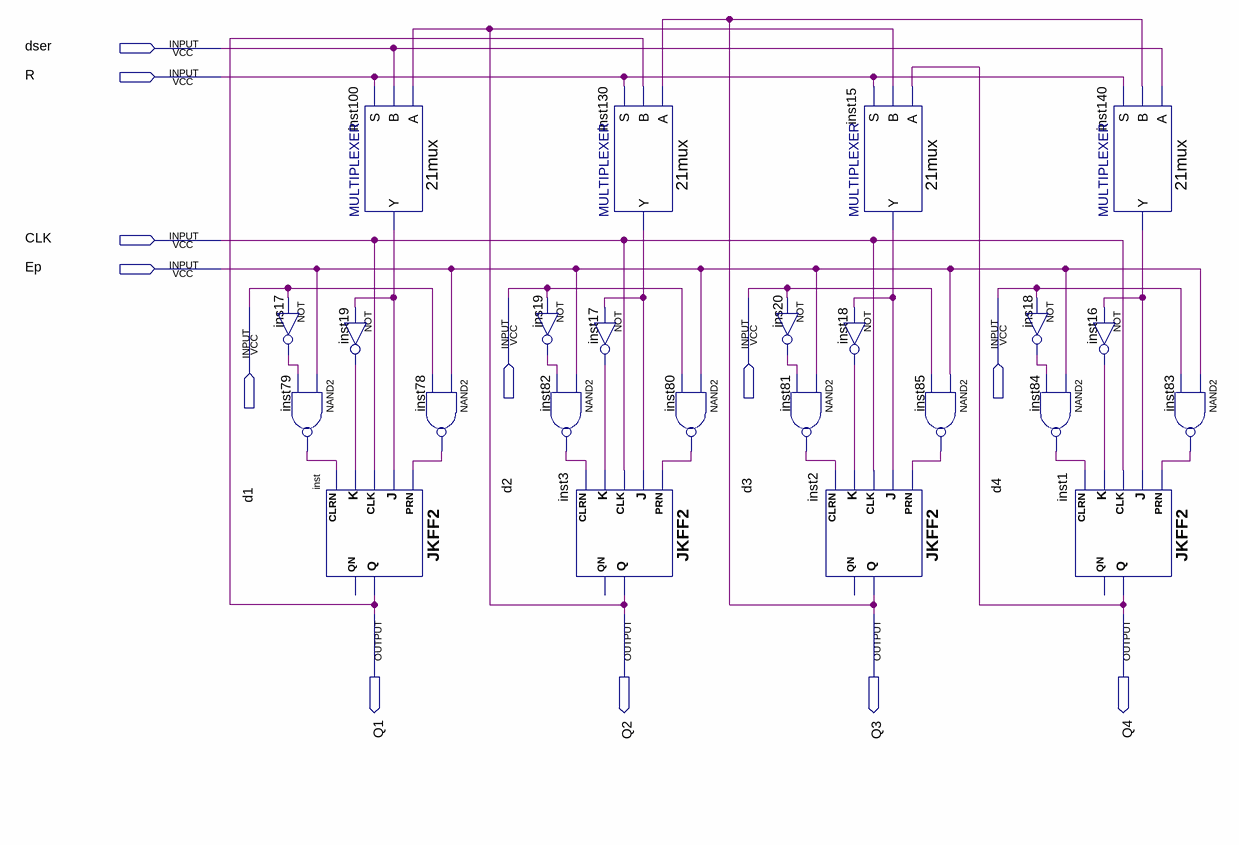
[diagram p0: schematic sheet]
// Quartus schematic q52.bdf as structural Verilog: 24 symbols, 12 pins
module q52 (
  input  dser,
  input  R,
  input  CLK,
  input  Ep,
  input  d2,
  input  d3,
  input  d4,
  input  d1,
  output Q1,
  output Q2,
  output Q3,
  output Q4
);

  wire ins17_out, ins18_out, ins19_out, ins20_out, inst15_y, inst16_out, inst17_out, inst18_out, inst19_out,
       inst78_out, inst79_out, inst80_out, inst81_out, inst82_out, inst83_out, inst84_out, inst85_out,
       inst100_y, inst130_y, inst140_y;

  not ins17 (ins17_out, d1);
  nand inst79 (inst79_out, Ep, ins17_out);
  \21mux  inst100 (.S(R), .B(dser), .A(Q2), .Y(inst100_y));
  not inst19 (inst19_out, inst100_y);
  JKFF2 inst (.K(inst19_out), .CLRN(inst79_out), .CLK(CLK), .PRN(inst78_out), .J(inst100_y), .Q(Q1));  // open: QN
  nand inst78 (inst78_out, Ep, d1);
  not ins19 (ins19_out, d2);
  not inst17 (inst17_out, inst130_y);
  nand inst82 (inst82_out, Ep, ins19_out);
  JKFF2 inst3 (.K(inst17_out), .CLRN(inst82_out), .CLK(CLK), .PRN(inst80_out), .J(inst130_y), .Q(Q2));  // open: QN
  \21mux  inst130 (.S(R), .B(Q1), .A(Q3), .Y(inst130_y));
  nand inst80 (inst80_out, Ep, d2);
  not ins20 (ins20_out, d3);
  nand inst81 (inst81_out, Ep, ins20_out);
  JKFF2 inst2 (.K(inst18_out), .CLRN(inst81_out), .CLK(CLK), .PRN(inst85_out), .J(inst15_y), .Q(Q3));  // open: QN
  \21mux  inst15 (.S(R), .B(Q2), .A(Q4), .Y(inst15_y));
  not inst18 (inst18_out, inst15_y);
  nand inst85 (inst85_out, Ep, d3);
  not ins18 (ins18_out, d4);
  nand inst84 (inst84_out, Ep, ins18_out);
  \21mux  inst140 (.S(R), .B(Q3), .A(dser), .Y(inst140_y));
  not inst16 (inst16_out, inst140_y);
  JKFF2 inst1 (.K(inst16_out), .CLRN(inst84_out), .CLK(CLK), .PRN(inst83_out), .J(inst140_y), .Q(Q4));  // open: QN
  nand inst83 (inst83_out, Ep, d4);
endmodule
